# EAGLE design Single_Item_Sensor_v2 (EAGLE 8.6.1)
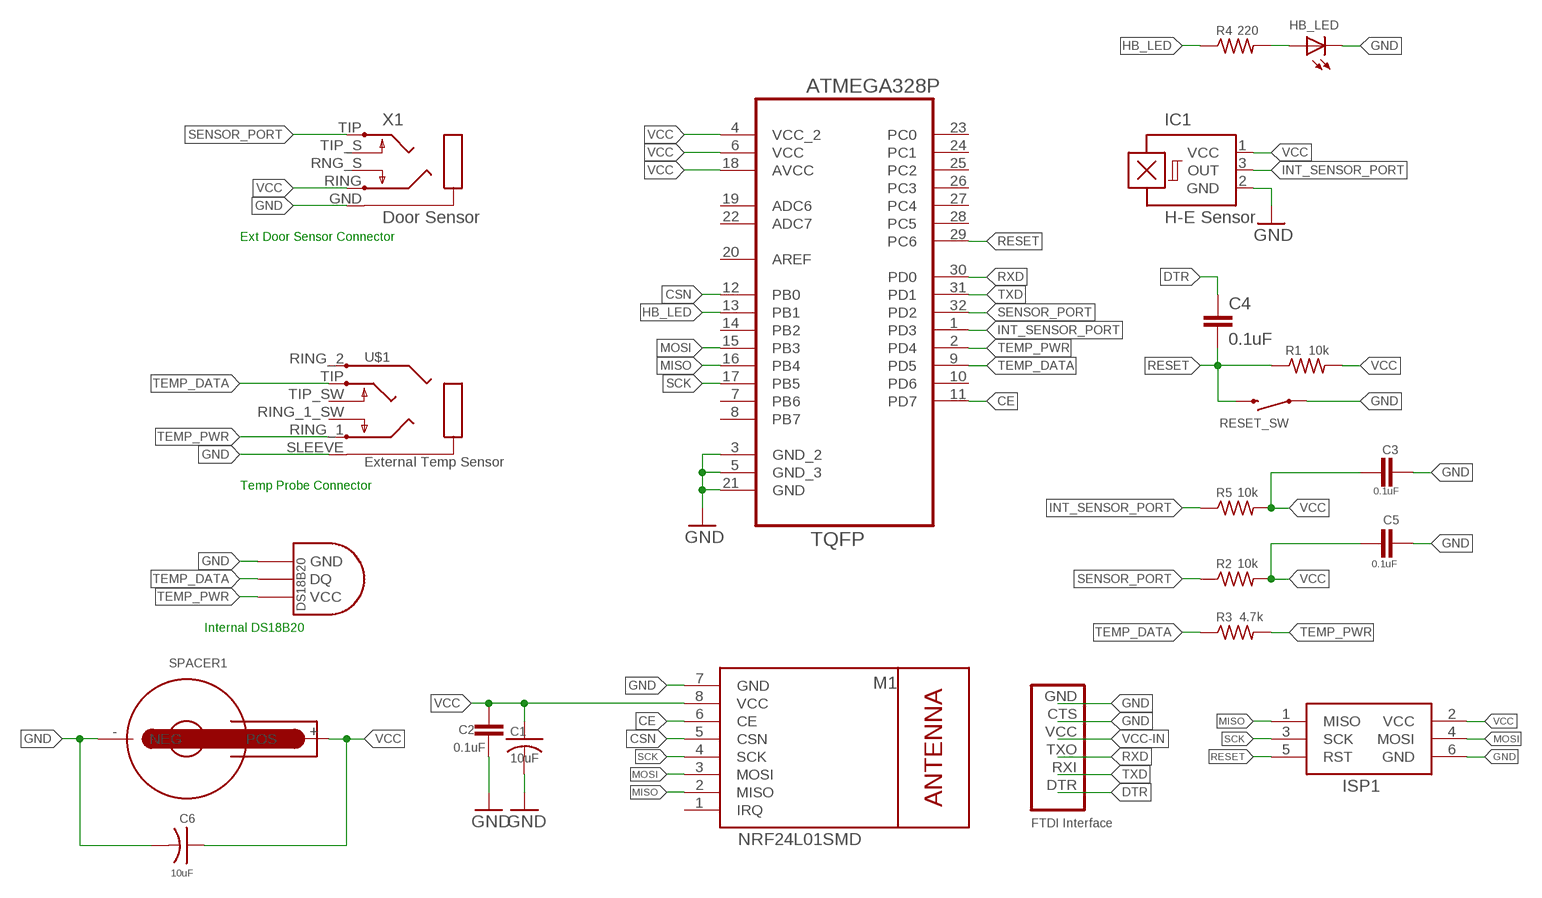
[diagram p0: schematic, sheet 1]

## Parts
C1  10uF  C-USC1206  [C1206]
C2  0.1uF  CAP0805  [0805]
C3  0.1uF  CAP0805  [0805]
C4  0.1uF  CAP0805  [0805]
C5  0.1uF  CAP0805  [0805]
C6  10uF  C-USC1206  [C1206]
HB_LED  LEDCHIP-LED0603  [CHIP-LED0603]
IC1  H-E Sensor  A1202UA  [SIP3-UA]
ISP1  AVRISP-6  [AVRISP]
M1  NRF24L01SMD  WIRELESS-NRF24L01SMD  [WIRELESS-NRF24L01-SMD]
R1  10k  R-US_M0805  [M0805]
R2  10k  R-US_M0805  [M0805]
R3  4.7k  R-US_M0805  [M0805]
R4  220  R-US_M0805  [M0805]
R5  10k  R-US_M0805  [M0805]
RESET_SW  Reset  SWITCH-MOMENTARY-2-SMD-1101NE  [TACTILE-SWITCH-1101NE]
SPACER1  WA-BCPH_SMT_79527141  [79527141]
U1  ATMEGA328P-AU  [QFP80P900X900X120-32N]
U$1  External Temp Sensor  PJ-242  [PJ-242]
U$2  DS1820TO92  [DS1820]
U$3  FTDI Interface  FTDI-HEADER  [1X6-FTDI]
X1  Door Sensor  PG203JPJ-328  [PG203J]

## Nets
CE: M1.6(CE) U1.11(PD7)
CSN: M1.5(CSN) U1.12(PB0)
DTR: C4.1 U$3.DTR
GND: C1.2 C2.2 C3.2 C5.2 C6.2 HB_LED.C IC1.2(GND) ISP1.6(GND) M1.7(GND) RESET_SW.P$1 SPACER1.-(NEG) U1.3(GND_2) U1.5(GND_3) U1.21(GND) U$1.SLEEVE U$2.GND U$3.CTS U$3.GND X1.GND
HB_LED: R4.1 U1.13(PB1)
INT_SENSOR_PORT: IC1.3(OUT) R5.1 U1.1(PD3)
LED+: HB_LED.A R4.2
MISO: ISP1.1(MISO) U1.16(PB4)
MOSI: ISP1.4(MOSI) U1.15(PB3)
RESET: C4.2 ISP1.5(RST) R1.1 RESET_SW.P$2 U1.29(PC6)
RXD: U1.30(PD0) U$3.TXO
SCK: ISP1.3(SCK) U1.17(PB5)
SENSOR_PORT: R2.1 U1.32(PD2) X1.TIP
TEMP_DATA: R3.1 U1.9(PD5) U$1.TIP U$2.DQ
TEMP_PWR: R3.2 U1.2(PD4) U$1.RING_1 U$2.VDD(VCC)
TXD: U1.31(PD1) U$3.RXI
VCC: C1.1 C2.1 C3.1 C5.1 C6.1 IC1.1(VCC) ISP1.2(VCC) M1.8(VCC) R1.2 R2.2 R5.2 SPACER1.+(POS) U1.4(VCC_2) U1.6(VCC) U1.18(AVCC) X1.RING
VCC-IN: U$3.VCC
Unconnected: M1.1(IRQ) M1.2(MISO) M1.3(MOSI) M1.4(SCK) U1.7(PB6) U1.8(PB7) U1.10(PD6) U1.14(PB2) U1.19(ADC6) U1.20(AREF) U1.22(ADC7) U1.23(PC0) U1.24(PC1) U1.25(PC2) U1.26(PC3) U1.27(PC4) U1.28(PC5) U$1.RING_1_SW U$1.RING_2 U$1.TIP_SW X1.RNG_S X1.TIP_S

## Notes on the sheet
- Ext Door Sensor Connector
- Temp Probe Connector
- Internal DS18B20

## Library data of the parts
C1 C6 = adafruit:C-US: CAPACITOR, American symbol
C2-C5 = GDOv5 Board:CAP: Capacitor Standard 0603 ceramic capacitor, and 0.1" leaded capacitor.
HB_LED = GDOv5 Board:LED: LED OSRAM: - CHIPLED LG R971, LG N971, LY N971, LG Q971, LY Q971, LO R971, LY R971 LH N974, LH R974 LS Q976, LO Q976, LY Q976 LO Q996 - Hyper CHIPLED LW Q18S LB Q993, LB Q99A, LB R99A - SideLED LS A670, LO A670, LY A670, LG A670, LP A670 LB A673, LV A673, LT A673, LW A673 LH A674 LY A675 LS A676, LA A676, LO A676, LY A676, LW A676 LS A679, LY A679, LG A679 - Hyper Micro SIDELED® LS Y876, LA Y876, LO Y876, LY Y876 LT Y87S - SmartLED LW L88C, LW L88S LB L89C, LB L89S, LG L890 LS L89K, LO L89K, LY L89K LS L896, LA L896, LO L896, LY L896 - TOPLED LS T670, LO T670, LY T670, LG T670, LP T670 LSG T670, LSP T670, LSY T670, LOP T670, LYG T670 LG T671, LOG T671, LSG T671 LB T673, LV T673, LT T673, LW T673 LH T674 LS T676, LA T676, LO T676, LY T676, LB T676, LH T676, LSB T676, LW T676 LB T67C, LV T67C, LT T67C, LS T67K, LO T67K, LY T67K, LW E67C LS E67B, LA E67B, LO E67B, LY E67B, LB E67C, LV E67C, LT E67C LW T67C LS T679, LY T679, LG T679 LS T770, LO T770, LY T770, LG T770, LP T770 LB T773, LV T773, LT T773, LW T773 LH T774 LS E675, LA E675, LY E675, LS T675 LS T776, LA T776, LO T776, LY T776, LB T776 LHGB T686 LT T68C, LB T68C - Hyper Mini TOPLED® LB M676 - Mini TOPLED Santana® LG M470 LS M47K, LO M47K, LY M47K Source: http://www.osram.convergy.de/
IC1 = allegro:A12*?: Hall-effect bipolar switch Source: http://www.allegromicro.com/en/Products/Part_Numbers/1202/1202.pdf; OC_FARNELL: unknown; OC_NEWARK: unknown
ISP1 = adafruit:AVRISP: AVR ISP HEADER Standard 6 pin header for AVR programming
M1 = nrf24l01plus:WIRELESS-NRF24L01: 2.4 GHz Wireless Module based on NRF24L01 chip
R1-R5 = adafruit:R-US_: RESISTOR, American symbol
RESET_SW = GDOv5 Board:SWITCH-MOMENTARY-2: Various NO switches- pushbuttons, reed, etc
SPACER1 = EAGLE-BATTERY_HOLDERS-rev16b:WA-BCPH: Battery Holder WA-BCPH Characteristics Flammability rating UL94-V0 Material is Phosphor Bronze Comliance:Lead free and RoHs Packaging unit is 500 <http://katalog.we-online.de/media/images/v2/Battery_Holder_group.jpg> Details see: http://katalog.we-online.de/en/em/BCPH_BATTERY_HOLDER/79527141 2015 (C) Wurth Elektronik
U1 = Ava:ATMEGA328P-AU; DESCRIPTION: 8-bit Microcontroller with In-System Programmable Flash; MPN: ATMEGA328P-AU; OC_FARNELL: 1715486; OC_NEWARK: 14R4631; PACKAGE: TQFP-32; SUPPLIER: Atmel
U$1 = GDOv5 Board:PJ-242: 2.5mm TRRS minijack with switches on T1/R1
U$2 = Ava:DS1820: DS18B20 Programmable Resolution 1-Wire Digital Thermometer Description The DS18B20 digital thermometer provides 9-bit to 12-bit Celsius temperature measurements and has an alarm function with nonvolatile user-programmable upper and lower trigger points. The DS18B20 communicates over a 1-Wire® bus that by definition requires only one data line (and ground) for communication with a central microprocessor. It has an operating temperature range of -55°C to +125°C and is accurate to ±0.5°C over the range of -10°C to +85°C. In addition, the DS18B20 can derive power directly from the data line ("parasite power"), eliminating the need for an external power supply. Each DS18B20 has a unique 64-bit serial code, which allows multiple DS18B20s to function on the same 1-Wire bus. Thus, it is simple to use one microprocessor to control many DS18B20s distributed over a large area. Applications that can benefit from this feature include HVAC environmental controls, temperature monitoring systems inside buildings, equipment, or machinery, and process monitoring and control systems.
U$3 = GDOv5 Board:FTDI-HEADER
X1 = GDOv5 Board:PG203J: 3.5mm Mic/Headphone Jack Stereo microphone/headphone jack PJ-328

## Board
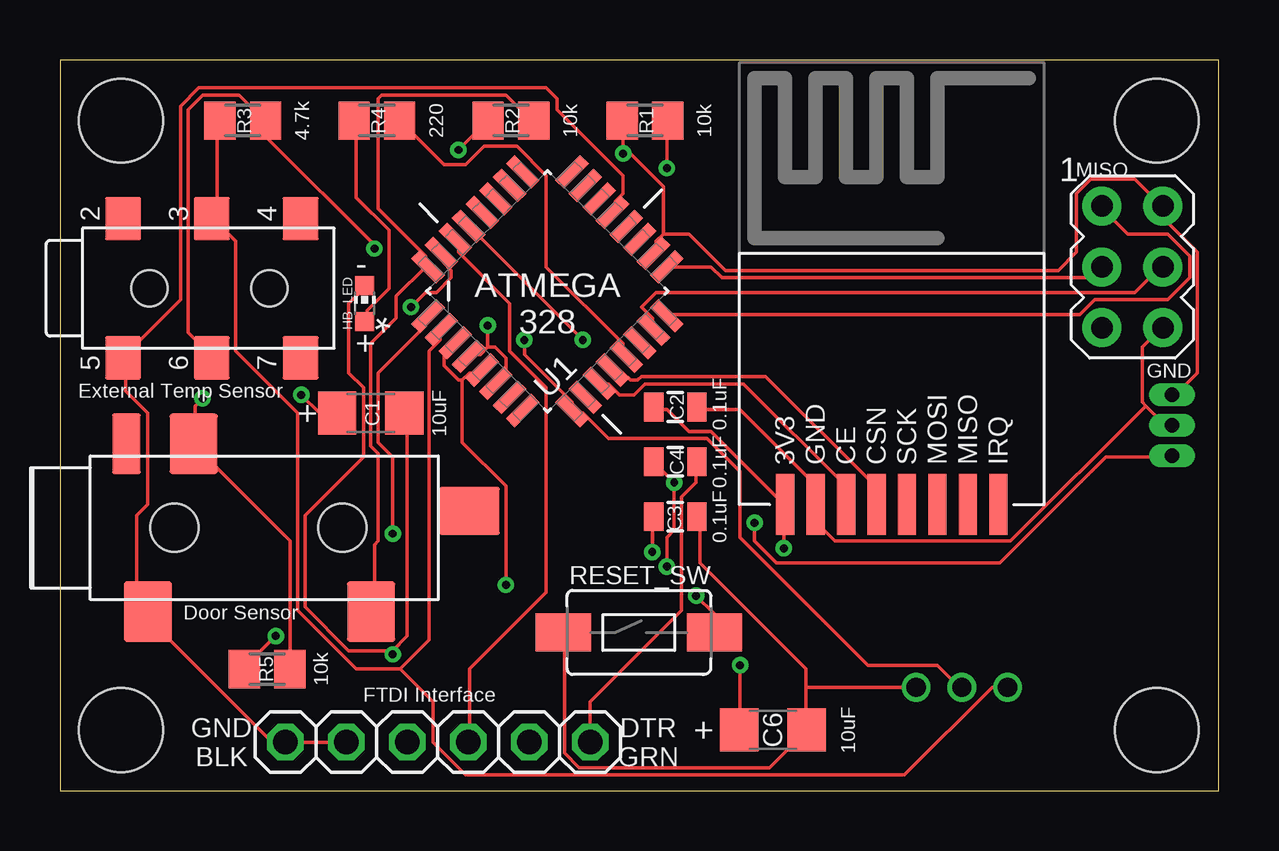
[diagram p1: board, top side]
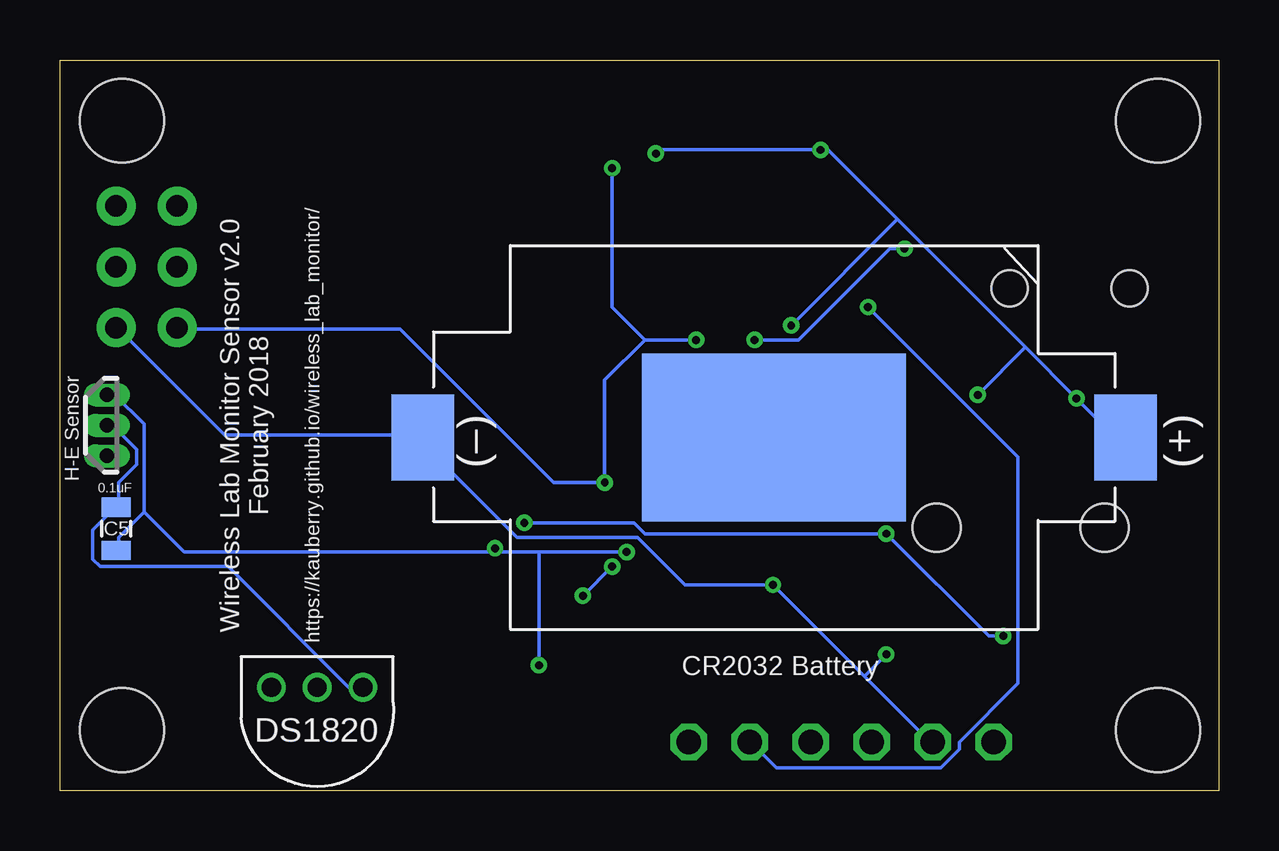
[diagram p2: board, bottom side, seen from below]

Size 48.31 x 30.47 mm. Coordinates in mm from the lower left corner, seen from the top.
Outline: 0,0 48.31,0 48.31,30.47 0,30.47 0,0
Copper layers (1*16): Top 0.0356mm / dielectric 1.5011mm / Bottom 0.0356mm
Design rules "oshpark-2layer *": minimum track width 6mil, minimum drill 13mil, track to track 6mil, track to pad 6mil, pad to pad 6mil, via to via 6mil, smd to smd 6mil, copper to edge 15mil, drill to drill 6mil, minimum pad ring 7mil, minimum via ring 7mil, stop-mask expansion 2.5mil, vias tented up to drill 0mil, thermal gap 10mil
Holes 3.5 mm at 2.54,27.94 45.72,27.94 2.54,2.54 45.72,2.54
tKeepout: area 31.1,21.8 to 31.2,29.7
tRestrict: area 27.9,21.8 to 41.4,30.5
bRestrict: area 30.5,21.6 to 48.3,30.5; area 43.2,0 to 48.3,5.1; area 0,0 to 5.1,5.1; area 0,25.4 to 5.1,30.5

### Footprints (pad centres in the part's own frame; a part is rotated, then mirrored left to right if it is on the bottom)
C1206 = smd 1.6 x 1.8: 1 -1.4,0; 2 1.4,0
0805 = smd 0.8 x 1.2: 1 -0.9,0; 2 0.9,0
CHIP-LED0603 = smd 0.8 x 0.8: A 0,-0.75; C 0,0.75
SIP3-UA = drill 0.6 pad 0.7 long: 1 -1.27,0; 2 0,0; 3 1.27,0
AVRISP = drill 0.9 pad 1.626: 1 -1.27,2.54; 2 1.27,2.54; 3 -1.27,0; 4 1.27,0; 5 -1.27,-2.54; 6 1.27,-2.54
WIRELESS-NRF24L01-SMD = smd 2.54 x 0.762: 1 1.27,0; 2 1.27,1.27; 3 1.27,2.54; 4 1.27,3.81; 5 1.27,5.08; 6 1.27,6.35; 7 1.27,7.62; 8 1.27,8.89
M0805 = smd 1.3 x 1.6: 1 -0.95,0; 2 0.95,0
TACTILE-SWITCH-1101NE = smd 2.3 x 1.6: P$1 -3.15,0; P$2 3.15,0
79527141 = smd 2.6 x 3.6: + 14.65,0; - -14.65,0 | smd 11 x 7: PS1 0,0
QFP80P900X900X120-32N = smd 1.473 x 0.508: 1 -4.242,2.794; 2 -4.242,2.007; 3 -4.242,1.194; 4 -4.242,0.406; 5 -4.242,-0.406; 6 -4.242,-1.194; 7 -4.242,-2.007; 8 -4.242,-2.794; 17 4.242,-2.794; 18 4.242,-2.007; 19 4.242,-1.194; 20 4.242,-0.406; 21 4.242,0.406; 22 4.242,1.194; 23 4.242,2.007; 24 4.242,2.794 | smd 0.508 x 1.473: 9 -2.794,-4.242; 10 -2.007,-4.242; 11 -1.194,-4.242; 12 -0.406,-4.242; 13 0.406,-4.242; 14 1.194,-4.242; 15 2.007,-4.242; 16 2.794,-4.242; 25 2.794,4.242; 26 2.007,4.242; 27 1.194,4.242; 28 0.406,4.242; 29 -0.406,4.242; 30 -1.194,4.242; 31 -2.007,4.242; 32 -2.794,4.242
PJ-242 = smd 1.5 x 1.8: RING_1 -5.1,2.9; RING_1_SW -1.4,2.9; RING_2 -8.8,2.9; SLEEVE -8.8,-2.9; TIP -5.1,-2.9; TIP_SW -1.4,-2.9 | hole 1.5: -7.7,0; -2.7,0
DS1820 = drill 0.8: DQ 2.54,-1.27; GND 0.635,-1.27; VDD 4.445,-1.27
1X6-FTDI = drill 1.016 octagon: CTS 3.81,0; DTR -6.35,0; GND 6.35,0; RXI -3.81,0; TXO -1.27,0; VCC 1.27,0
PG203J = smd 2 x 2.5: GND 2.4,-6.5; RING 4.3,0.5; TIP 11.7,-6.5 | smd 1.2 x 2.5: RNG_S 1.5,0.5 | smd 2.5 x 2: TIP_S 15.8,-2.3 | hole 2: 3.5,-3; 10.5,-3

### Placement (x,y rotation side)
C1  12.95,15.75 0 top
C2  25.65,16 0 top
C3  25.65,11.43 0 top
C4  25.65,13.72 180 top
C5  45.96,10.92 90 bottom
C6  29.72,2.54 0 top
HB_LED  12.7,20.32 0 top
IC1  46.35,15.24 270 bottom
ISP1  44.7,21.84 0 top
M1  39.12,10.67 90 top
R1  24.38,27.94 180 top
R2  18.8,27.94 180 top
R3  7.62,27.94 180 top
R4  13.21,27.94 180 top
R5  8.64,5.08 0 top
RESET_SW  24.13,6.6 0 top
SPACER1  18.54,14.73 0 bottom
U1  20.32,20.83 45 top
U$1  11.43,20.95 0 top
U$2  35.05,3.05 180 bottom
U$3  15.75,2.03 180 top
X1  1.27,13.97 0 top

### Tracks (layer width: path | path; a pad name or v marks a point on that pad's centre or on a via)
CE
  Top 0.152: M1.6 32.77,12.7 28.5,16.97 24.38,16.97 23.93,16.51 23.32,16.51 22.86,16.97 22.55,16.97 U1.11
CSN
  Top 0.152: U1.12 23.16,17.42 23.47,17.42 23.77,17.12 24.08,17.12 24.23,17.27 29.41,17.27 33.98,12.7 33.98,11.94 M1.5
DTR
  Top 0.152: U$3.DTR 22.1,3.71 25.91,7.52 25.91,12.24 26.52,12.85 26.52,13.61 C4.1
GND  (via drill 0.33)
  Top 0.152: 31.09,4.32 31.09,2.64 C6.2 31.09,2.49 29.57,0.97 21.64,0.97 21.03,1.58 21.03,6.6 RESET_SW.P$1 | 31.09,4.32 31.09,5.08 26.67,9.5 26.67,11.33 C3.2 | 31.09,4.32 U$2.GND | C2.2 26.67,15.9 28.35,15.9 31.39,12.85 31.39,11.94 M1.7 31.55,11.94 31.55,11.18 32.31,10.41 39.62,10.41 45.26,16.05 | 45.26,16.05 45.11,16.2 45.11,18.49 45.87,19.25 ISP1.6 | 45.26,16.05 46.02,15.29 46.33,15.29 IC1.2 | U1.21 23.16,24.13 23.16,24.59 23.47,24.89 23.47,25.65 20.73,28.4 20.73,28.85 20.27,29.31 5.79,29.31 5.03,28.55 5.03,20.47 2.74,18.19 U$1.SLEEVE 2.74,18.03 2.74,16.66 3.66,15.75 3.66,11.94 3.2,11.48 3.2,7.98 3.66,7.52 X1.GND 3.81,7.37 3.81,7.06 8.84,2.03 U$3.GND U$3.CTS | 13.87,5.84 12.04,5.84 10.21,7.67 10.21,11.48 12.65,13.92 12.65,16.81 12.04,17.42 12.04,20.32 12.65,20.93 HB_LED.C | 13.87,5.84 14.48,6.45 14.48,15.75 C1.2 | 16.76,17.12 17.07,17.42 17.53,17.42 U1.5 | 16.76,17.12 16.61,17.12 16,17.73 16,18.19 16.46,18.64 U1.3 | 16.76,17.12 16.76,14.53 18.59,12.7 v18.59,8.59 | v13.87,5.69 13.87,5.84
  Bottom 0.152: IC1.2 46.33,15.14 46.02,15.14 45.11,14.22 45.11,13.61 45.87,12.85 45.87,11.94 C5.2 46.02,11.79 46.94,10.87 46.94,9.65 46.63,9.35 41.3,9.35 36.27,4.32 U$2.GND | ISP1.6 45.87,19.25 41.45,14.83 33.22,14.83 SPACER1.- 33.07,14.68 33.07,14.38 29.26,10.57 24.23,10.57 22.25,8.59 v18.59,8.59 14.78,4.78 | 14.78,4.78 12.04,2.03 U$3.CTS | 14.78,4.78 v13.87,5.69
HB_LED
  Top 0.152: U1.13 23.47,18.19 23.47,18.64 20.27,21.84 20.27,25.65 19.05,26.87 17.68,26.87 16.92,26.11 16,26.11 14.17,27.94 R4.1
INT_SENSOR_PORT  (via drill 0.33)
  Top 0.152: v13.87,10.72 13.87,13.92 13.26,14.53 13.26,17.42 15.24,19.41 15.24,19.71 U1.1 | v8.99,6.45 7.62,5.08 R5.1 | v28.96,11.18 28.96,10.41 29.87,9.5 39.17,9.5 43.59,13.92 46.33,13.92 IC1.3
  Bottom 0.152: v8.99,6.45 9.6,6.45 v13.87,10.72 23.93,10.72 24.38,11.18 v28.96,11.18
LED+
  Top 0.152: HB_LED.A 12.8,19.71 12.8,20.02 13.72,20.93 13.72,23.37 12.34,24.74 12.34,27.94 R4.2
MISO
  Top 0.152: U1.16 25.3,19.86 42.52,19.86 43.13,20.47 46.18,20.47 47.09,21.39 47.09,22.3 46.18,23.22 44.5,23.22 43.43,24.28 ISP1.1
MOSI
  Top 0.152: U1.15 24.69,19.25 24.69,19.71 24.23,20.17 24.84,20.78 44.81,20.78 45.87,21.84 ISP1.4
RESET  (via drill 0.33)
  Top 0.152: C4.2 24.84,13.61 v25.6,12.85 25.6,10.87 25.3,10.57 v25.3,9.35 | v21.79,18.8 17.07,23.52 U1.29 | v25.3,25.96 25.3,27.94 R1.1 | RESET_SW.P$2 27.28,7.37 v26.52,8.13 | RESET_SW.P$2
  Bottom 0.152: ISP1.5 43.43,19.25 34.14,19.25 27.74,12.85 v25.6,12.85 25.6,17.12 23.93,18.8 | 23.93,18.8 v21.79,18.8 | v25.3,25.96 25.3,20.17 23.93,18.8 | v25.3,9.35 v26.52,8.13
RXD
  Top 0.152: U1.30 16.61,22.91 16.61,22.45 18.75,20.32 18.75,18.34 20.27,16.81 20.27,8.28 17.07,5.08 17.07,2.03 U$3.TXO
SCK
  Top 0.152: ISP1.3 42.98,21.39 27.58,21.39 27.13,21.84 U1.17
SENSOR_PORT
  Top 0.152: R2.1 19.66,27.94 18.59,29.01 13.41,29.01 13.26,28.85 13.26,24.28 15.24,22.3 15.24,22 U1.32 15.24,21.84 14.02,20.62 14.02,19.71 12.95,18.64 12.95,14.38 13.26,14.07 13.26,10.41 13.11,10.26 13.11,7.52 X1.TIP
TEMP_DATA  (via drill 0.33)
  Top 0.152: U$1.TIP 6.25,18.19 5.33,19.1 5.33,28.4 5.94,29.01 7.47,29.01 8.53,27.94 R3.1 8.69,27.94 8.69,27.18 13.11,22.76 v13.11,22.61 | U$2.DQ 37.49,4.32 36.58,5.23 33.68,5.23 28.35,10.57 28.35,13.31 26.98,14.68 22.86,14.68 21.79,15.75 21.49,15.75 U1.9 21.34,15.9 21.34,16.2 19.36,18.19 v19.36,18.8
  Bottom 0.152: v13.11,22.61 13.72,22.61 17.53,18.8 v19.36,18.8
TEMP_PWR
  Top 0.152: 14.17,5.08 15.39,6.3 15.39,18.34 15.85,18.8 15.85,19.1 U1.2 | 14.17,5.08 12.34,5.08 9.91,7.52 9.91,15.75 7.32,18.34 7.32,22.91 6.4,23.83 U$1.RING_1 6.4,23.98 6.55,24.13 6.55,27.94 R3.2 | U$2.VDD 38.86,4.32 35.2,0.66 16.92,0.66 15.54,2.03 15.54,3.71 14.17,5.08
TXD  (via drill 0.33)
  Top 0.152: v14.63,20.17 15.24,20.78 15.7,20.78 16.31,21.39 16.31,21.69 16,22 16,22.3 U1.31
  Bottom 0.152: v14.63,20.17 8.38,13.92 8.38,4.47 10.82,2.03 10.82,1.73 11.58,0.97 18.44,0.97 19.51,2.03 U$3.RXI
VCC  (via drill 0.33)
  Top 0.152: R5.2 9.6,5.08 9.6,10.41 5.64,14.38 X1.RING 5.64,14.53 5.64,16.05 v5.94,16.36 | 17.83,18.49 17.53,18.19 17.07,18.19 U1.4 | 17.83,18.49 18.14,18.49 18.59,18.03 18.59,17.42 18.29,17.12 U1.6 | v16.61,26.72 17.83,27.94 R2.2 | C1.1 10.82,15.75 v10.06,16.51 | v17.83,19.41 17.83,18.49 | 30.18,11.94 27.13,14.99 26.21,14.99 25.3,15.9 24.84,15.9 C2.1 | 25.15,23.22 24.84,22.91 24.84,22.45 U1.18 | 25.15,23.22 25.15,25.2 23.62,26.72 | 23.62,26.72 23.47,26.87 23.47,27.94 R1.2 | v24.69,9.96 24.69,11.33 C3.1 | v28.35,5.23 28.35,2.64 C6.1 | IC1.1 46.48,16.51 47.4,17.42 47.4,22.45 46.02,23.83 46.02,24.28 ISP1.2 45.87,24.44 44.81,25.5 42.98,25.5 42.37,24.89 42.37,22.45 41.6,21.69 27.74,21.69 26.21,23.22 25.15,23.22 | v30.18,10.11 30.18,11.94 | 30.18,11.94 M1.8 | 23.62,26.72 v23.47,26.57
  Bottom 0.152: 8.08,18.49 v5.94,16.36 4.42,14.83 3.96,14.83 SPACER1.+ | 8.08,18.49 13.41,23.83 | 13.41,23.83 16.31,26.72 v16.61,26.72 23.32,26.72 v23.47,26.57 | 8.08,18.49 v10.06,16.51 | 13.41,23.83 v17.83,19.41 | 44.81,11.63 45.87,10.57 45.87,10.11 C5.1 | 44.81,11.63 44.81,15.29 46.02,16.51 IC1.1 | 30.18,9.96 43.13,9.96 44.81,11.63 | 30.18,9.96 28.35,9.96 | 28.35,9.96 v24.69,9.96 | 28.35,9.96 v28.35,5.23 | 30.18,9.96 v30.18,10.11

### Text on the board
tPlace: ATMEGA / 328
bPlace: https://kauberry.github.io/wireless_lab_monitor/ | Wireless Lab Monitor Sensor v2.0 / February 2018
tNames: MISO | - | + | GND | + | 0.1uF | +
bNames: (+) | (–) | CR2032 Battery